# Altium project OpenRing-V1R0-Temperature.PrjPcb
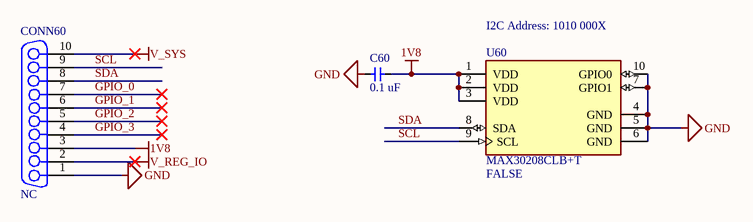
[diagram p0: OpenRing_Temperature.SchDoc]
1 sheet, 3 parts. Net scope: global (net labels, ports and power ports of the same name join across sheets).
Board file: OpenRing-V1R0-Temperature.PcbDoc

## Sheet OpenRing_Temperature.SchDoc
size A4; Size: A4; SheetNumber: 1; SheetTotal: 1

### Parts
C60  0.1 uF  [CAPC1005X05N]
CONN60  NC  [51281-1098-PCB]
U60  MAX30208CLB+T  Checked: FALSE  [FP-L1022-2-MFG]

### Nets
1V8: C60.1 CONN60.3 U60.1(VDD) U60.2(VDD) U60.3(VDD)
GND: C60.2 CONN60.1 U60.4(GND) U60.5(GND) U60.6(GND) U60.7(GPIO1) U60.10(GPIO0)
V_REG_IO: CONN60.2
V_SYS: CONN60.10
GPIO_0: CONN60.7
GPIO_1: CONN60.6
GPIO_2: CONN60.5
GPIO_3: CONN60.4
SCL: CONN60.9 U60.9(SCL)
SDA: CONN60.8 U60.8(SDA)

### Notes on the sheet
- (near U60) I2C Address: 1010 000X
- Designer/Engineer
- Drawn By
- Document Name
- Board Title
- Sheet
- of
- Size
- A4
- Approved By
- Rev.
- Date

### Library data of the parts
C60 = GRM155R61C104KA88D: CAP CER 0.1UF 16V X5R 0402; Manufacturer: Murata Electronics; Tolerance: 10 %; Type: Chip Multilayer Ceramic Capacitor for General Purpose; Voltage Rating DC: 16 VDC; Capacitance - nF: 100 nF; Capacitance - pF: 100000 pF; Manufacturer Part Number: GRM155R61C104KA88D; RoHS: RoHS Compliant; Category: Multilayer Ceramic Capacitors MLCC - SMD/SMT; Stock: 0; Pricing: 1=0.082, 10=0.026, 100=0.011, 500=0.008, 1000=0.007, 2500=0.006, 5000=0.005, 10000=0.004 (EUR); Capacitance: 0.1 uF; Height: 0.5 mm; Length: 1 mm; Package / Case: 0402 (1005 metric); Packaging: Cut Tape; Product: General Type MLCCs; Series: GRM; Termination Style: SMD/SMT; Width: 0.5 mm; Brand: Murata Electronics; Case Code - in: 0402; Case Code - mm: 1005; Dielectric: X5R; Maximum Operating Temperature: + 85 C; Minimum Operating Temperature: - 55 C; Standard Pack Qty: 10000; Termination: Standard; RoHS - Mouser: Y; Minimum Order Quantity: 1; Reeling: True; ComponentLink1URL: http://www.mouser.com/datasheet/2/281/murata_03052018_GRM_Series_1-1310166.pdf; ComponentLink1Description: http://www.mouser.com/datasheet/2/281/murata_03052018_GRM_Series_1-1310166.pdf; Value: 0.1 uF; Supplier 1: Mouser; Supplier Part Number 1: 81-GRM155R61C104KA8D; Supplier 2: Digikey; Supplier Part Number 2: 490-5415-1-ND; Supplier 3: Digikey; Supplier Part Number 3: 490-5415-6-ND
CONN60 = 51281-1098-PCB: System: Connector
U60 = MAX30208CLB+T: I2C Digital Temperature Sensor Serial I2C 10-Pin Thin LGA T/R; Manufacturer: Maxim; Supplier: Mouser; Supplier Part Number: 700-MAX30208CLB+T; Manufacturer Part Number: MAX30208CLB+T; RoHS: Yes; Category: Temperature and Humidity Sensors; Stock: 16152; Pricing: 1=3.7, 10=2.9, 50=2.9, 100=2.69, 1000=2.11, 10000=1.97 (USD); Supplier 1: Mouser; Supplier Part Number 1: 700-MAX30208CLB+T; Supplier 2: Digikey; Supplier Part Number 2: 175-MAX30208CLB+TDKR-ND; Supplier 3: Digikey; Supplier Part Number 3: 175-MAX30208CLB+TTR-ND